# Altium schematic sheet Sheet2.SchDoc
size A4
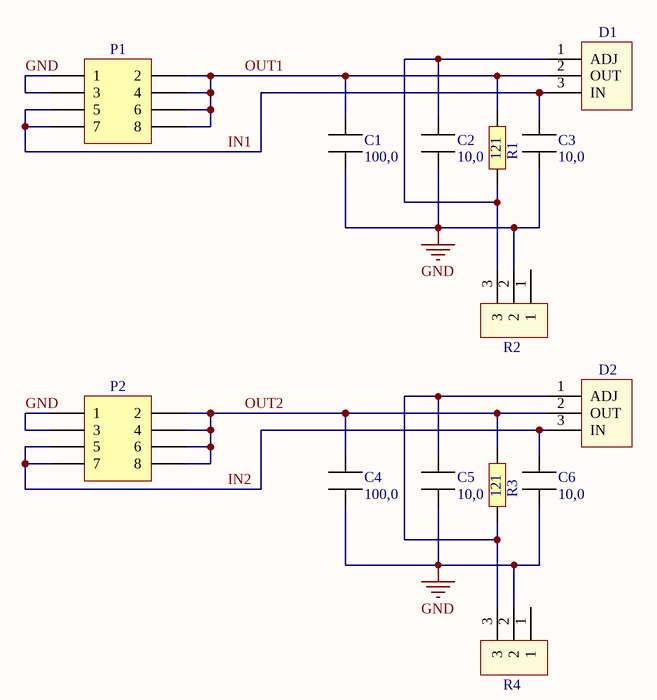
[diagram p0: Sheet2.SchDoc]

## Parts
C1  100,0  [Cap_BIG]
C2  10,0  [Cap_BIG]
C3  10,0  [Cap_BIG]
C4  100,0  [Cap_BIG]
C5  10,0  [Cap_BIG]
C6  10,0  [Cap_BIG]
D1  LM1117-ADJ  [LM1117]  (value not drawn)
D2  LM1117-ADJ  [LM1117]  (value not drawn)
P1  Header 4X2  [HDR2X4]  (value not drawn)
P2  Header 4X2  [HDR2X4]  (value not drawn)
R1  121  [RES]
R2  3296  [PODSTR_RES_3296]  (value not drawn)
R3  121  [RES]
R4  3296  [PODSTR_RES_3296]  (value not drawn)

## Nets
GND: C1.1 C2.1 C3.1 C4.1 C5.1 C6.1 P1.1 P1.3 P2.1 P2.3 R2.2 R4.2
IN1: C3.2 D1.3(IN) P1.5 P1.7
IN2: C6.2 D2.3(IN) P2.5 P2.7
OUT1: C1.2 D1.2(OUT) P1.2 P1.4 P1.6 P1.8 R1.2
OUT2: C4.2 D2.2(OUT) P2.2 P2.4 P2.6 P2.8 R3.2
NetC2_2: C2.2 D1.1(ADJ) R1.1 R2.3
NetC5_2: C5.2 D2.1(ADJ) R3.1 R4.3

Not connected (* = marked no-connect by the designer): R2 1; R4 1

## Library data of the parts
C1-C6 = CAP_BIG
P1 P2 = Header 4X2: Header, 4-Pin, Dual row; LatestRevisionDate: 17-Jul-2002; LatestRevisionNote: Re-released for DXP Platform.; Publisher: Altium Limited
R1 R3 = RES
R2 R4 = PODSTR_RES_NEW